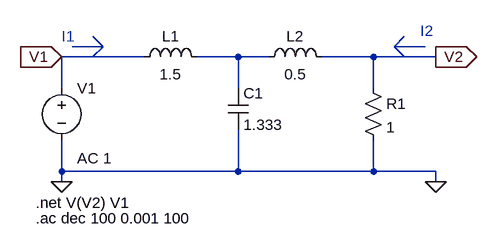
[diagram p0: schematic Ejercicio2.asc]
Ejercicio2.asc, the LTspice schematic file:
Version 4
SHEET 1 880 680
WIRE 128 80 0 80
WIRE 272 80 208 80
WIRE 320 80 272 80
WIRE 480 80 400 80
WIRE 576 80 480 80
WIRE 0 128 0 80
WIRE 272 128 272 80
WIRE 480 128 480 80
WIRE 0 256 0 208
WIRE 272 256 272 192
WIRE 272 256 0 256
WIRE 480 256 480 208
WIRE 480 256 272 256
WIRE 576 256 480 256
WIRE 0 272 0 256
WIRE 576 272 576 256
FLAG 576 80 V2
IOPIN 576 80 Out
FLAG 0 80 V1
IOPIN 0 80 In
FLAG 576 272 0
FLAG 0 272 0
SYMBOL voltage 0 112 R0
WINDOW 123 24 124 Left 2
WINDOW 39 0 0 Left 0
SYMATTR Value2 AC 1
SYMATTR InstName V1
SYMATTR Value ""
SYMBOL ind 112 96 R270
WINDOW 0 32 56 VTop 2
WINDOW 3 5 56 VBottom 2
SYMATTR InstName L1
SYMATTR Value 1.5
SYMBOL ind 304 96 R270
WINDOW 0 32 56 VTop 2
WINDOW 3 5 56 VBottom 2
SYMATTR InstName L2
SYMATTR Value 0.5
SYMBOL cap 256 128 R0
SYMATTR InstName C1
SYMATTR Value 1.333
SYMBOL res 464 112 R0
SYMATTR InstName R1
SYMATTR Value 1
TEXT -40 304 Left 2 !.net V(V2) V1
TEXT -40 328 Left 2 !.ac dec 100 0.001 100
TEXT 0 48 Left 2 ;I1
TEXT 552 40 Left 2 ;I2
LINE Normal 512 64 560 64
LINE Normal 528 48 512 64
LINE Normal 512 64 528 48
LINE Normal 528 80 512 64
LINE Normal 64 64 16 64
LINE Normal 48 48 64 64
LINE Normal 64 64 48 48
LINE Normal 48 80 64 64

The netlist it stands for:
* Ejercicio2.asc
V1 V1 0 AC 1
L1 V1 N001 1.5
L2 N001 V2 0.5
C1 N001 0 1.333
R1 V2 0 1
.net V(V2) V1
.ac dec 100 0.001 100
* I1
* I2
.backanno
.end